# EAGLE schematic RasPiTimePowerSW_WithSTTS751 (EAGLE 7.7.0)
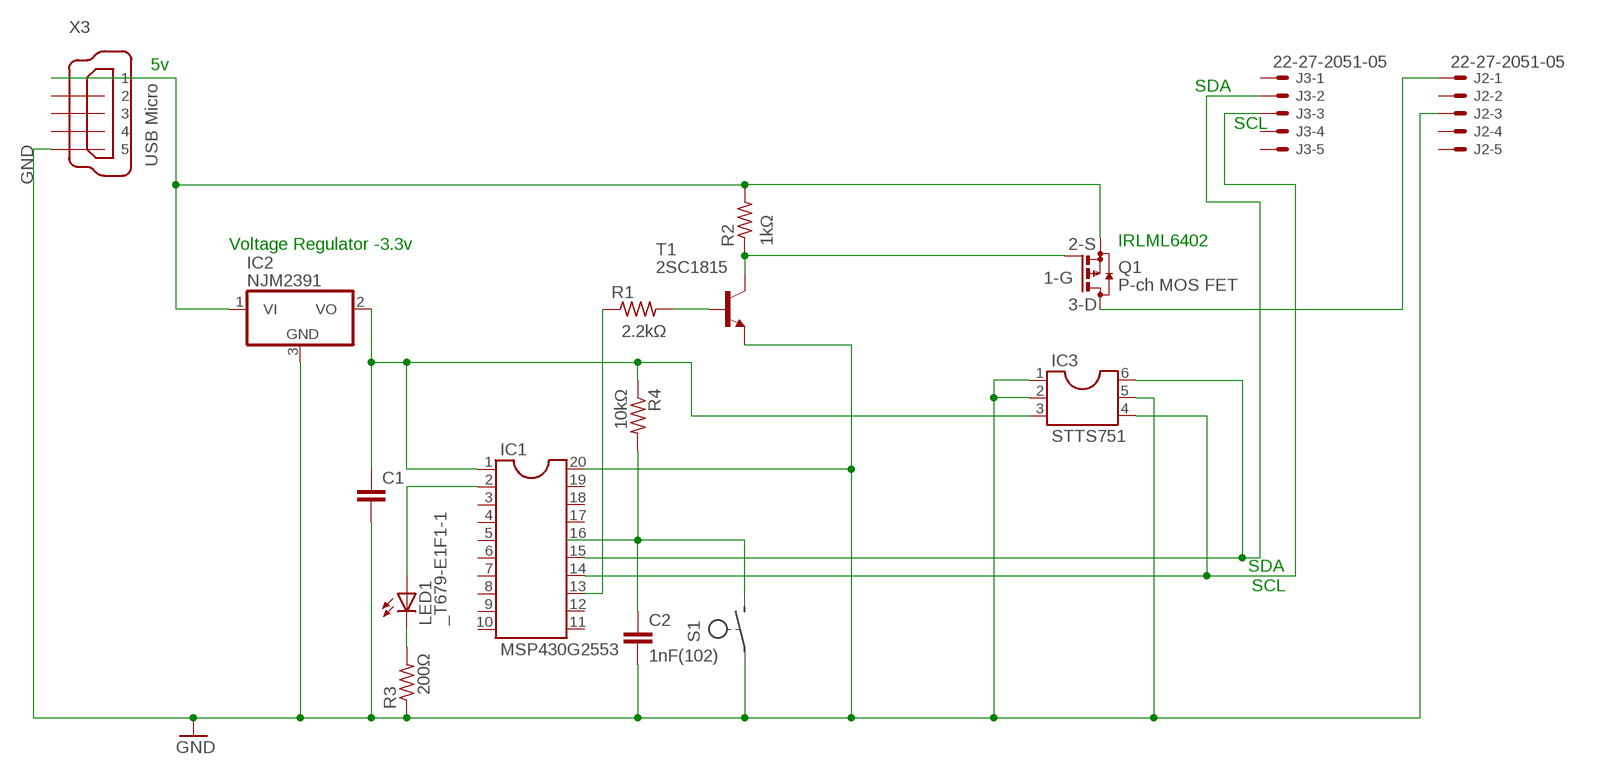
[diagram p0: schematic, sheet 1]

## Parts
C1  C-EU075-042X103  [C075-042X103]
C2  1nF(102)  C-EU025-024X044  [C025-024X044]
IC1  MSP430G2553  DIL20S  [SOCKET-20]
IC2  NJM2391  7805DT  [TO252]
IC3  STTS751  DIL6  [DIL06]
J2  22-27-2051-05  [6410-05]
J3  22-27-2051-05  [6410-05]
LED1  _T679-E1F1-1  LG_T679-E1F1-1  [PLCC2]
Q1  P-ch MOS FET  BSS84  [SOT23]
R1  R-US_M1206  [M1206]
R2  R-US_M1206  [M1206]
R3  R-US_M1206  [M1206]
R4  10kΩ  R-US_M1206  [M1206]
T1  2SC1815  [TO92-ECB]
X3  USB Micro  MINI-USB_SHIELD5P4-32005-400  [32005-400]

## Nets
GND: C1.2 C2.2 IC1.20 IC2.3(GND) IC3.1 IC3.2 IC3.5 J2.3 R3.1 T1.E X3.5
N$1: R1.2 T1.B
N$2: C1.1 IC1.1 IC2.2(VO) IC3.3 R4.1
N$3: IC1.14 IC3.4 J3.3
N$4: IC1.15 IC3.6 J3.2
N$5: IC1.13 R1.1
N$6: Q1.1(G) R2.1 T1.C
N$8: IC1.2 LED1.A
N$9: LED1.C R3.2
N$10: C2.1 R4.2
N$11: J2.1 Q1.3(D)
N$13: IC2.1(VI) Q1.2(S) R2.2 X3.1
Unconnected: IC1.3 IC1.4 IC1.5 IC1.6 IC1.7 IC1.8 IC1.9 IC1.10 IC1.11 IC1.12 IC1.16 IC1.17 IC1.18 IC1.19 J2.2 J2.4 J2.5 J3.1 J3.4 J3.5 X3.2 X3.3 X3.4 X3.M1(S1) X3.M2(S2) X3.M3(S3) X3.M4(S4)

## Notes on the sheet
- 5v
- SDA
- SCL
- Voltage Regulator -3.3v | 2-S | IRLML6402
- 1-G
- 3-D
- SDA
- SCL

## Library data of the parts
C1 C2 = resistor:C-EU: CAPACITOR, European symbol
IC1 = ic-package:DIL20: Dual In Line / Socket
IC2 = linear:78*: Positive VOLTAGE REGULATOR Source: http://cache.national.com/ds/LM/LM78L05.pdf http://www.fairchildsemi.com/ds/LM/LM7805.pdf
IC3 = ic-package:DIL6: Dual In Line / Socket
J2 J3 = con-molex:22-?-05: CONNECTOR wire to board 2.54 mm (.1 inch) pitch header; OC_FARNELL: unknown; OC_NEWARK: unknown
LED1 = led:*_T679-?-1: LC TOPLED® Low Current LED Source: http://catalog.osram-os.com .. LG_LS_LY_T679_OBS.pdf; COLOR: green
Q1 = transistor-small-signal:BSS84: P-CHANNEL MOS FET
R1 = resistor:R-US_: RESISTOR, American symbol; R: 2.2kΩ
R2 = resistor:R-US_: RESISTOR, American symbol; 1K: 1kΩ
R3 = resistor:R-US_: RESISTOR, American symbol; R: 200Ω
R4 = resistor:R-US_: RESISTOR, American symbol
T1 = transistor:2SC1815: NPN EPITAXIAL TRANSISTOR Source: TOSHIBA .. 2SC1815 1.pdf
X3 = con-cypressindustries:MINI-USB_SHIELD5P4-: MINI USB-B R/A W/O POST 5 pol. Source: www.cypressindustries.com; OC_FARNELL: unknown; OC_NEWARK: unknown